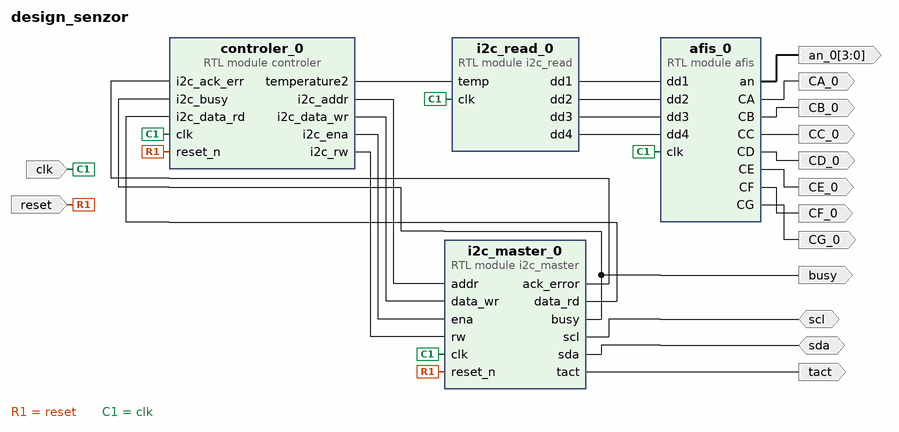
[diagram p0: block diagram of the top level]
# Vivado block design design_senzor, xc7a35tcpg236-1, Vivado 2022.2
create_bd_design design_senzor

create_bd_port -dir O CA_0
create_bd_port -dir O CB_0
create_bd_port -dir O CC_0
create_bd_port -dir O CD_0
create_bd_port -dir O CE_0
create_bd_port -dir O CF_0
create_bd_port -dir O CG_0
create_bd_port -dir I reset
create_bd_port -dir IO sda
create_bd_port -dir IO scl
create_bd_port -dir O busy
create_bd_port -dir O tact
create_bd_port -dir I clk
create_bd_port -dir O -from 3 -to 0 an_0

create_bd_cell -type module -reference i2c_read i2c_read_0
create_bd_cell -type module -reference afis afis_0
create_bd_cell -type module -reference controler controler_0
create_bd_cell -type module -reference i2c_master i2c_master_0

# ---- connections ----

connect_bd_net [get_bd_ports reset] [get_bd_pins controler_0/reset_n] [get_bd_pins i2c_master_0/reset_n]
connect_bd_net [get_bd_ports sda] [get_bd_pins i2c_master_0/sda]
connect_bd_net [get_bd_ports scl] [get_bd_pins i2c_master_0/scl]
connect_bd_net [get_bd_pins afis_0/CA] [get_bd_ports CA_0]
connect_bd_net [get_bd_pins afis_0/CB] [get_bd_ports CB_0]
connect_bd_net [get_bd_pins afis_0/CC] [get_bd_ports CC_0]
connect_bd_net [get_bd_pins afis_0/CD] [get_bd_ports CD_0]
connect_bd_net [get_bd_pins afis_0/CE] [get_bd_ports CE_0]
connect_bd_net [get_bd_pins afis_0/CF] [get_bd_ports CF_0]
connect_bd_net [get_bd_pins afis_0/CG] [get_bd_ports CG_0]
connect_bd_net [get_bd_pins afis_0/an] [get_bd_ports an_0]
connect_bd_net [get_bd_ports clk] [get_bd_pins i2c_read_0/clk] [get_bd_pins afis_0/clk] [get_bd_pins controler_0/clk] [get_bd_pins i2c_master_0/clk]
connect_bd_net [get_bd_pins controler_0/i2c_addr] [get_bd_pins i2c_master_0/addr]
connect_bd_net [get_bd_pins controler_0/i2c_data_wr] [get_bd_pins i2c_master_0/data_wr]
connect_bd_net [get_bd_pins controler_0/i2c_ena] [get_bd_pins i2c_master_0/ena]
connect_bd_net [get_bd_pins controler_0/i2c_rw] [get_bd_pins i2c_master_0/rw]
connect_bd_net [get_bd_pins controler_0/temperature2] [get_bd_pins i2c_read_0/temp]
connect_bd_net [get_bd_pins i2c_master_0/ack_error] [get_bd_pins controler_0/i2c_ack_err]
connect_bd_net [get_bd_pins i2c_master_0/busy] [get_bd_ports busy] [get_bd_pins controler_0/i2c_busy]
connect_bd_net [get_bd_pins i2c_master_0/data_rd] [get_bd_pins controler_0/i2c_data_rd]
connect_bd_net [get_bd_pins i2c_master_0/tact] [get_bd_ports tact]
connect_bd_net [get_bd_pins i2c_read_0/dd1] [get_bd_pins afis_0/dd1]
connect_bd_net [get_bd_pins i2c_read_0/dd2] [get_bd_pins afis_0/dd2]
connect_bd_net [get_bd_pins i2c_read_0/dd3] [get_bd_pins afis_0/dd3]
connect_bd_net [get_bd_pins i2c_read_0/dd4] [get_bd_pins afis_0/dd4]

validate_bd_design
save_bd_design
